# EAGLE board Ringo3 (EAGLE 5.11), part 1 of 2
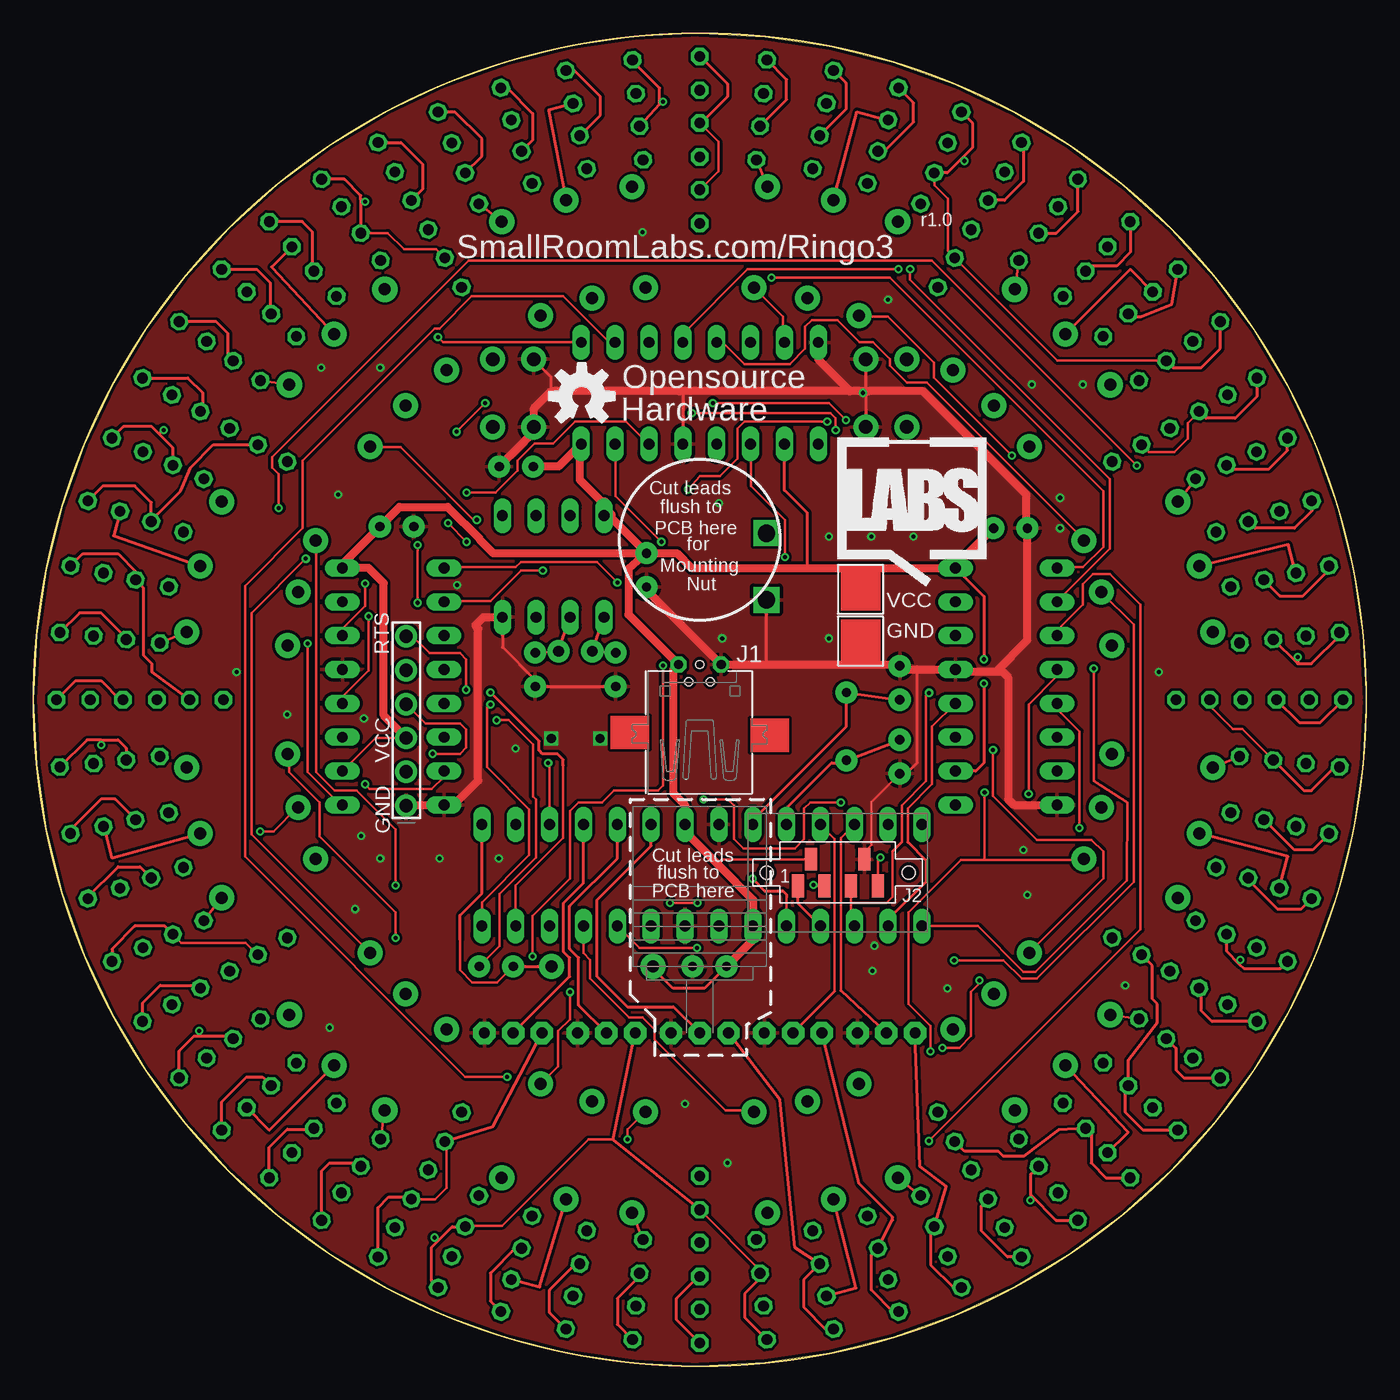
[diagram p2: board, top side]
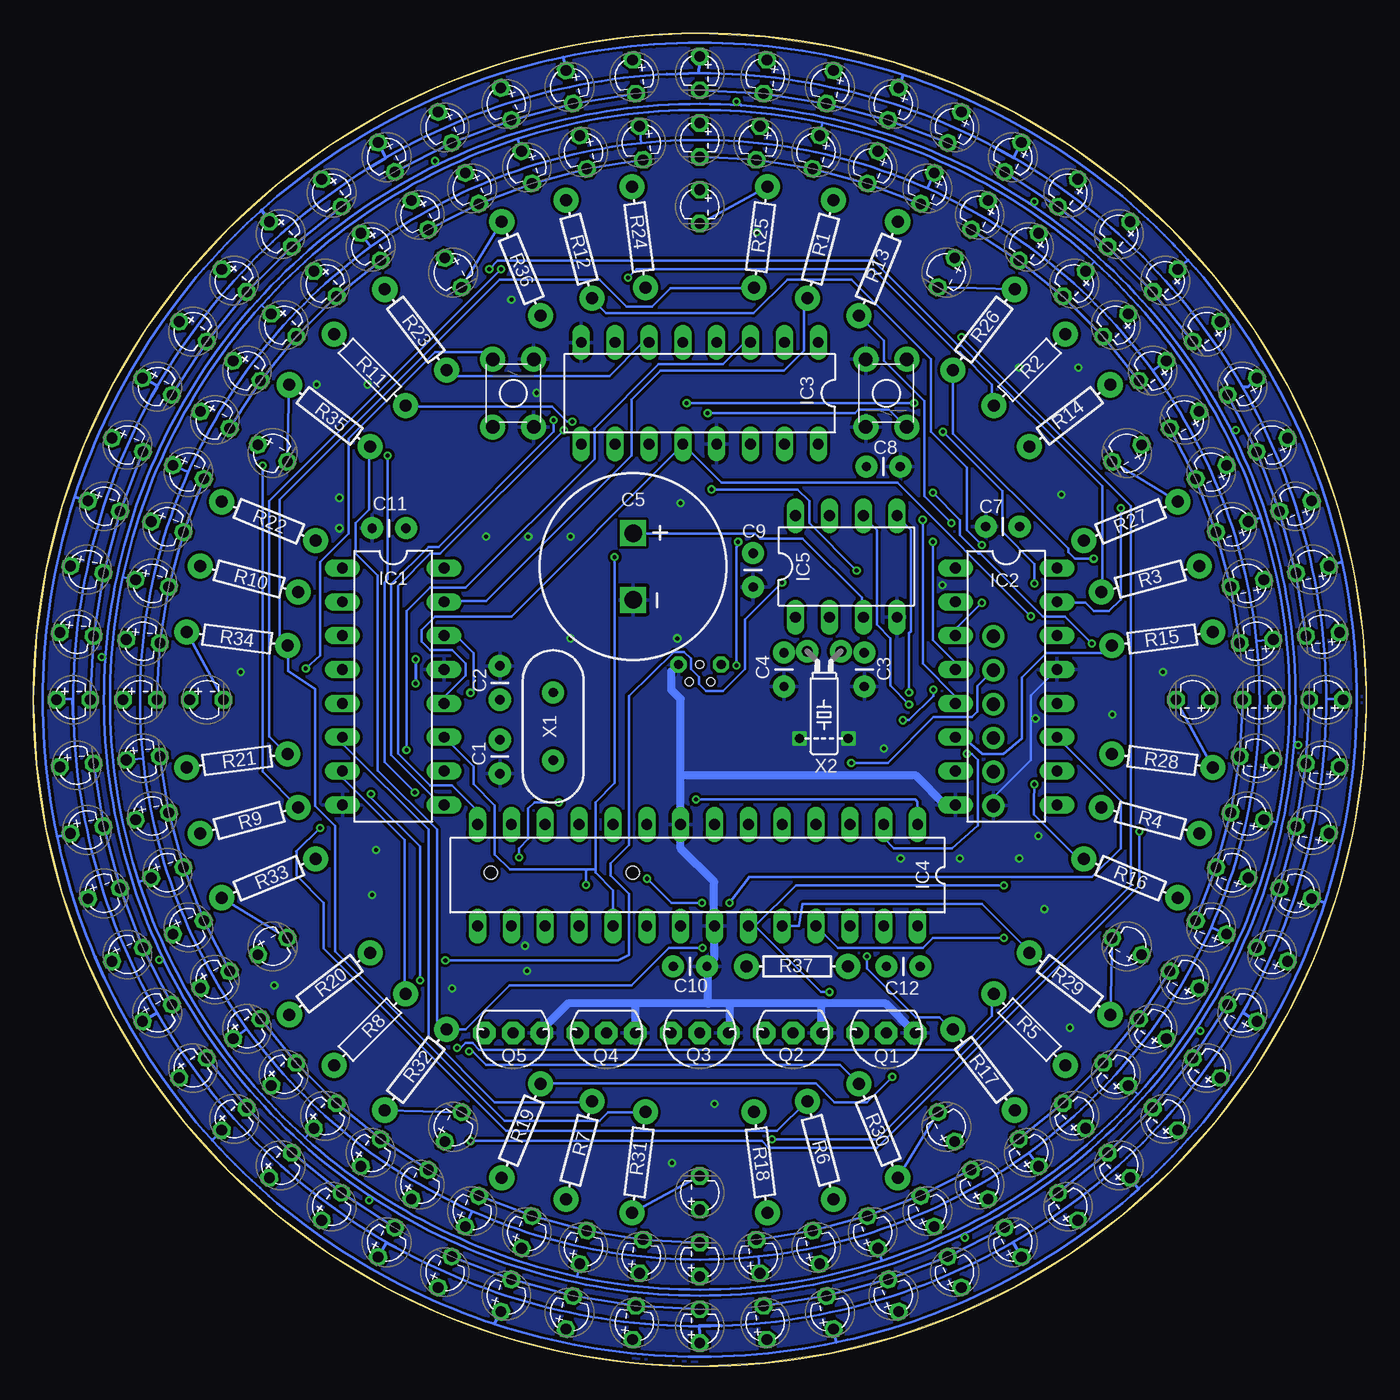
[diagram p3: board, bottom side, seen from below]

Size 100 x 100 mm. Coordinates in mm from the lower left corner, seen from the top.
Outline: 50,100 arc-180 50,0 arc-180 50,100
Copper layers (1*16): Top 0.035mm / dielectric 1.5mm / Bottom 0.035mm
Design rules "Fusion_eagle_rule_v1.1": minimum track width 6mil, minimum drill 12mil, track to track 6mil, track to pad 6mil, pad to pad 6mil, via to via 6mil, smd to smd 0mil, copper to edge 10mil, drill to drill 10mil, minimum pad ring 10mil, minimum via ring 6mil, stop-mask expansion 2mil, vias tented up to drill 100mil, thermal gap 10mil
Net classes: 0 default: width 0.203 mm, drill 0.305 mm, clearance 0.203 mm; 1 power: width 0.203 mm, drill 0.305 mm, clearance 0.203 mm
Milling: area 0,0 to 100,100

## Footprints (pad centres in the part's own frame; a part is rotated, then mirrored left to right if it is on the bottom)
CAP-PTH-SMALL = drill 0.7 pad 1.651 round: 1 0,0; 2 2.54,0
CAP-SUPER13/5 = drill 1.3 square: A -2.5,0; C 2.5,0
1X06_ROUND = drill 1 pad 1.676 round: 1 -6.35,0; 2 -3.81,0; 3 -1.27,0; 4 1.27,0; 5 3.81,0; 6 6.35,0
LED3MM = drill 0.8 octagon: A -1.27,0; C 1.27,0
DIL16 = drill 0.813 long: 1 -8.89,-3.81; 2 -6.35,-3.81; 3 -3.81,-3.81; 4 -1.27,-3.81; 5 1.27,-3.81; 6 3.81,-3.81; 7 6.35,-3.81; 8 8.89,-3.81; 9 8.89,3.81; 10 6.35,3.81; 11 3.81,3.81; 12 1.27,3.81; 13 -1.27,3.81; 14 -3.81,3.81; 15 -6.35,3.81; 16 -8.89,3.81
DIL28-3 = drill 0.813 long: 1 -16.51,-3.81; 2 -13.97,-3.81; 3 -11.43,-3.81; 4 -8.89,-3.81; 5 -6.35,-3.81; 6 -3.81,-3.81; 7 -1.27,-3.81; 8 1.27,-3.81; 9 3.81,-3.81; 10 6.35,-3.81; 11 8.89,-3.81; 12 11.43,-3.81; 13 13.97,-3.81; 14 16.51,-3.81; 15 16.51,3.81; 16 13.97,3.81; 17 11.43,3.81; 18 8.89,3.81; 19 6.35,3.81; 20 3.81,3.81; 21 1.27,3.81; 22 -1.27,3.81; 23 -3.81,3.81; 24 -6.35,3.81; 25 -8.89,3.81; 26 -11.43,3.81; 27 -13.97,3.81; 28 -16.51,3.81
DIL08-LONG = drill 0.813 long: 1 -3.81,-3.81; 2 -1.27,-3.81; 3 1.27,-3.81; 4 3.81,-3.81; 5 3.81,3.81; 6 1.27,3.81; 7 -1.27,3.81; 8 -3.81,3.81
USB-MINIB-PTH-PWR-PAD = drill 0.7 octagon: GND 1.6,4.64; VBUS -1.6,4.64 | hole 0.6: 0,4.648; 0.787,3.353; -0.813,3.353
ISP-TOUCH = smd 0.9 x 1.7: 1 -3,-1; 2 -2,1; 3 -1,-1; 4 1,-1; 5 3,-1; 6 2,1 | hole 1: -5.334,0; 5.334,0
TO92-STRAIGHT = drill 0.813 pad 1.676 octagon: 1 -2.159,0; 2 0,0; 3 2.159,0
AXIAL-0.3 = drill 0.9 pad 1.88 round: P$1 -3.81,0; P$2 3.81,0
TACTILE-PTH-4.5X4.5 = drill 1.016 pad 1.88 round: 1A -2.54,1.54; 1B 2.54,1.54; 2A -2.54,-1.54; 2B 2.54,-1.54
HC49US = drill 0.7 pad 1.651 round: 1 -2.54,0; 2 2.54,0
TC26H = drill 0.813 pad 1.676 round: 1 -1.27,0; 2 1.27,0

## Placement (x,y rotation side)
C1  [CAP-PTH-SMALL]  65,47 270 bottom
C2  [CAP-PTH-SMALL]  65,50 90 bottom
C3  [CAP-PTH-SMALL]  37.66,53.53 270 bottom
C4  [CAP-PTH-SMALL]  43.69,53.53 270 bottom
C5  CAPPOLSUPER13/5  [CAP-SUPER13/5]  55,60 270 bottom
C7  [CAP-PTH-SMALL]  26,63 180 bottom
C8  [CAP-PTH-SMALL]  37.5,67.5 0 bottom
C9  [CAP-PTH-SMALL]  46,61 270 bottom
C10  [CAP-PTH-SMALL]  52,30 0 bottom
C11  [CAP-PTH-SMALL]  72.04,62.87 180 bottom
C12  [CAP-PTH-SMALL]  36,30 0 bottom
CN1  [1X06_ROUND]  27.97,48.4 90 top
D1  LED3MM  [LED3MM]  50,97 270 bottom
D2  LED3MM  [LED3MM]  45.09,96.74 264 bottom
D3  LED3MM  [LED3MM]  40.23,95.97 258 bottom
D4  LED3MM  [LED3MM]  35.48,94.7 252 bottom
D5  LED3MM  [LED3MM]  30.88,92.94 246 bottom
D6  LED3MM  [LED3MM]  26.5,90.7 240 bottom
D7  LED3MM  [LED3MM]  22.37,88.02 234 bottom
D8  LED3MM  [LED3MM]  18.55,84.93 228 bottom
D9  LED3MM  [LED3MM]  15.07,81.45 222 bottom
D10  LED3MM  [LED3MM]  11.98,77.63 216 bottom
D11  LED3MM  [LED3MM]  9.3,73.5 210 bottom
D12  LED3MM  [LED3MM]  7.06,69.12 204 bottom
D13  LED3MM  [LED3MM]  5.3,64.52 198 bottom
D14  LED3MM  [LED3MM]  4.03,59.77 192 bottom
D15  LED3MM  [LED3MM]  3.26,54.91 186 bottom
D16  LED3MM  [LED3MM]  3,50 180 bottom
D17  LED3MM  [LED3MM]  3.26,45.09 174 bottom
D18  LED3MM  [LED3MM]  4.03,40.23 168 bottom
D19  LED3MM  [LED3MM]  5.3,35.48 162 bottom
D20  LED3MM  [LED3MM]  7.06,30.88 156 bottom
D21  LED3MM  [LED3MM]  9.3,26.5 150 bottom
D22  LED3MM  [LED3MM]  11.98,22.37 144 bottom
D23  LED3MM  [LED3MM]  15.07,18.55 138 bottom
D24  LED3MM  [LED3MM]  18.55,15.07 132 bottom
D25  LED3MM  [LED3MM]  22.37,11.98 126 bottom
D26  LED3MM  [LED3MM]  26.5,9.3 120 bottom
D27  LED3MM  [LED3MM]  30.88,7.06 114 bottom
D28  LED3MM  [LED3MM]  35.48,5.3 108 bottom
D29  LED3MM  [LED3MM]  40.23,4.03 102 bottom
D30  LED3MM  [LED3MM]  45.09,3.26 96 bottom
D31  LED3MM  [LED3MM]  50,3 90 bottom
D32  LED3MM  [LED3MM]  54.91,3.26 84 bottom
D33  LED3MM  [LED3MM]  59.77,4.03 78 bottom
D34  LED3MM  [LED3MM]  64.52,5.3 72 bottom
D35  LED3MM  [LED3MM]  69.12,7.06 66 bottom
D36  LED3MM  [LED3MM]  73.5,9.3 60 bottom
D37  LED3MM  [LED3MM]  77.63,11.98 54 bottom
D38  LED3MM  [LED3MM]  81.45,15.07 48 bottom
D39  LED3MM  [LED3MM]  84.93,18.55 42 bottom
D40  LED3MM  [LED3MM]  88.02,22.37 36 bottom
D41  LED3MM  [LED3MM]  90.7,26.5 30 bottom
D42  LED3MM  [LED3MM]  92.94,30.88 24 bottom
D43  LED3MM  [LED3MM]  94.7,35.48 18 bottom
D44  LED3MM  [LED3MM]  95.97,40.23 12 bottom
D45  LED3MM  [LED3MM]  96.74,45.09 6 bottom
D46  LED3MM  [LED3MM]  97,50 0 bottom
D47  LED3MM  [LED3MM]  96.74,54.91 354 bottom
D48  LED3MM  [LED3MM]  95.97,59.77 348 bottom
D49  LED3MM  [LED3MM]  94.7,64.52 342 bottom
D50  LED3MM  [LED3MM]  92.94,69.12 336 bottom
D51  LED3MM  [LED3MM]  90.7,73.5 330 bottom
D52  LED3MM  [LED3MM]  88.02,77.63 324 bottom
D53  LED3MM  [LED3MM]  84.93,81.45 318 bottom
D54  LED3MM  [LED3MM]  81.45,84.93 312 bottom
D55  LED3MM  [LED3MM]  77.63,88.02 306 bottom
D56  LED3MM  [LED3MM]  73.5,90.7 300 bottom
D57  LED3MM  [LED3MM]  69.12,92.94 294 bottom
D58  LED3MM  [LED3MM]  64.52,94.7 288 bottom
D59  LED3MM  [LED3MM]  59.77,95.97 282 bottom
D60  LED3MM  [LED3MM]  54.91,96.74 276 bottom
D61  LED3MM  [LED3MM]  50,92 270 bottom
D62  LED3MM  [LED3MM]  45.61,91.77 264 bottom
D63  LED3MM  [LED3MM]  41.27,91.08 258 bottom
D64  LED3MM  [LED3MM]  37.02,89.94 252 bottom
D65  LED3MM  [LED3MM]  32.92,88.37 246 bottom
D66  LED3MM  [LED3MM]  29,86.37 240 bottom
D67  LED3MM  [LED3MM]  25.31,83.98 234 bottom
D68  LED3MM  [LED3MM]  21.9,81.21 228 bottom
D69  LED3MM  [LED3MM]  18.79,78.1 222 bottom
D70  LED3MM  [LED3MM]  16.02,74.69 216 bottom
D71  LED3MM  [LED3MM]  13.63,71 210 bottom
D72  LED3MM  [LED3MM]  11.63,67.08 204 bottom
D73  LED3MM  [LED3MM]  10.06,62.98 198 bottom
D74  LED3MM  [LED3MM]  8.92,58.73 192 bottom
D75  LED3MM  [LED3MM]  8.23,54.39 186 bottom
D76  LED3MM  [LED3MM]  8,50 180 bottom
D77  LED3MM  [LED3MM]  8.23,45.61 174 bottom
D78  LED3MM  [LED3MM]  8.92,41.27 168 bottom
D79  LED3MM  [LED3MM]  10.06,37.02 162 bottom
D80  LED3MM  [LED3MM]  11.63,32.92 156 bottom
D81  LED3MM  [LED3MM]  13.63,29 150 bottom
D82  LED3MM  [LED3MM]  16.02,25.31 144 bottom
D83  LED3MM  [LED3MM]  18.79,21.9 138 bottom
D84  LED3MM  [LED3MM]  21.9,18.79 132 bottom
D85  LED3MM  [LED3MM]  25.31,16.02 126 bottom
D86  LED3MM  [LED3MM]  29,13.63 120 bottom
D87  LED3MM  [LED3MM]  32.92,11.63 114 bottom
D88  LED3MM  [LED3MM]  37.02,10.06 108 bottom
D89  LED3MM  [LED3MM]  41.27,8.92 102 bottom
D90  LED3MM  [LED3MM]  45.61,8.23 96 bottom
D91  LED3MM  [LED3MM]  50,8 90 bottom
D92  LED3MM  [LED3MM]  54.39,8.23 84 bottom
D93  LED3MM  [LED3MM]  58.73,8.92 78 bottom
D94  LED3MM  [LED3MM]  62.98,10.06 72 bottom
D95  LED3MM  [LED3MM]  67.08,11.63 66 bottom
D96  LED3MM  [LED3MM]  71,13.63 60 bottom
D97  LED3MM  [LED3MM]  74.69,16.02 54 bottom
D98  LED3MM  [LED3MM]  78.1,18.79 48 bottom
D99  LED3MM  [LED3MM]  81.21,21.9 42 bottom
D100  LED3MM  [LED3MM]  83.98,25.31 36 bottom
D101  LED3MM  [LED3MM]  86.37,29 30 bottom
D102  LED3MM  [LED3MM]  88.37,32.92 24 bottom
D103  LED3MM  [LED3MM]  89.94,37.02 18 bottom
D104  LED3MM  [LED3MM]  91.08,41.27 12 bottom
D105  LED3MM  [LED3MM]  91.77,45.61 6 bottom
D106  LED3MM  [LED3MM]  92,50 0 bottom
D107  LED3MM  [LED3MM]  91.77,54.39 354 bottom
D108  LED3MM  [LED3MM]  91.08,58.73 348 bottom
D109  LED3MM  [LED3MM]  89.94,62.98 342 bottom
D110  LED3MM  [LED3MM]  88.37,67.08 336 bottom
D111  LED3MM  [LED3MM]  86.37,71 330 bottom
D112  LED3MM  [LED3MM]  83.98,74.69 324 bottom
D113  LED3MM  [LED3MM]  81.21,78.1 318 bottom
D114  LED3MM  [LED3MM]  78.1,81.21 312 bottom
D115  LED3MM  [LED3MM]  74.69,83.98 306 bottom
D116  LED3MM  [LED3MM]  71,86.37 300 bottom
D117  LED3MM  [LED3MM]  67.08,88.37 294 bottom
D118  LED3MM  [LED3MM]  62.98,89.94 288 bottom
D119  LED3MM  [LED3MM]  58.73,91.08 282 bottom
D120  LED3MM  [LED3MM]  54.39,91.77 276 bottom
D121  LED3MM  [LED3MM]  50,87 270 bottom
D122  LED3MM  [LED3MM]  31.5,82.04 240 bottom
D123  LED3MM  [LED3MM]  17.96,68.5 210 bottom
D124  LED3MM  [LED3MM]  13,50 180 bottom
D125  LED3MM  [LED3MM]  17.96,31.5 150 bottom
D126  LED3MM  [LED3MM]  31.5,17.96 120 bottom
D127  LED3MM  [LED3MM]  50,13 90 bottom
D128  LED3MM  [LED3MM]  68.5,17.96 60 bottom
D129  LED3MM  [LED3MM]  82.04,31.5 30 bottom
D130  LED3MM  [LED3MM]  87,50 0 bottom
D131  LED3MM  [LED3MM]  82.04,68.5 330 bottom
D132  LED3MM  [LED3MM]  68.5,82.04 300 bottom
IC1  74HCT595N  [DIL16]  73,51 270 bottom
IC2  74HCT595N  [DIL16]  27,51 270 bottom
IC3  74HCT595N  [DIL16]  50,73 180 bottom
IC4  MEGA8-P  [DIL28-3]  50.16,36.83 180 bottom
IC5  MCP79410DIL  [DIL08-LONG]  39,60 0 bottom
J1  USB-PWRPAD  [USB-MINIB-PTH-PWR-PAD]  50,48 0 top
J2  AVR-ISP6_TOUCH  [ISP-TOUCH]  60.35,37.03 0 top
Q1  N-FETSTR  [TO92-STRAIGHT]  36,25 180 bottom
Q2  N-FETSTR  [TO92-STRAIGHT]  43,25 180 bottom
Q3  N-FETSTR  [TO92-STRAIGHT]  50,25 180 bottom
Q4  N-FETSTR  [TO92-STRAIGHT]  57,25 180 bottom
Q5  N-FETSTR  [TO92-STRAIGHT]  64,25 180 bottom
R1  [AXIAL-0.3]  40.94,83.81 75 bottom
R2  [AXIAL-0.3]  25.25,74.75 45 bottom
R3  [AXIAL-0.3]  16.19,59.06 15 bottom
R4  [AXIAL-0.3]  16.19,40.94 345 bottom
R5  [AXIAL-0.3]  25.25,25.25 315 bottom
R6  [AXIAL-0.3]  40.94,16.19 285 bottom
R7  [AXIAL-0.3]  59.06,16.19 255 bottom
R8  [AXIAL-0.3]  74.75,25.25 225 bottom
R9  [AXIAL-0.3]  83.81,40.94 195 bottom
R10  [AXIAL-0.3]  83.81,59.06 165 bottom
R11  [AXIAL-0.3]  74.75,74.75 135 bottom
R12  [AXIAL-0.3]  59.06,83.81 105 bottom
R13  [AXIAL-0.3]  36.61,82.34 67.5 bottom
R14  [AXIAL-0.3]  22.23,71.31 37.5 bottom
R15  [AXIAL-0.3]  15.3,54.57 7.5 bottom
R16  [AXIAL-0.3]  17.66,36.61 337.5 bottom
R17  [AXIAL-0.3]  28.69,22.23 307.5 bottom
R18  [AXIAL-0.3]  45.43,15.3 277.5 bottom
R19  [AXIAL-0.3]  63.39,17.66 247.5 bottom
R20  [AXIAL-0.3]  77.77,28.69 217.5 bottom
R21  [AXIAL-0.3]  84.7,45.43 187.5 bottom
R22  [AXIAL-0.3]  82.34,63.39 157.5 bottom
R23  [AXIAL-0.3]  71.31,77.77 127.5 bottom
R24  [AXIAL-0.3]  54.57,84.7 97.5 bottom
R25  [AXIAL-0.3]  45.43,84.7 82.5 bottom
R26  [AXIAL-0.3]  28.69,77.77 52.5 bottom
R27  [AXIAL-0.3]  17.66,63.39 22.5 bottom
R28  [AXIAL-0.3]  15.3,45.43 352.5 bottom
R29  [AXIAL-0.3]  22.23,28.69 322.5 bottom
R30  [AXIAL-0.3]  36.61,17.66 292.5 bottom
R31  [AXIAL-0.3]  54.57,15.3 262.5 bottom
R32  [AXIAL-0.3]  71.31,22.23 232.5 bottom
R33  [AXIAL-0.3]  82.34,36.61 202.5 bottom
R34  [AXIAL-0.3]  84.7,54.57 172.5 bottom
R35  [AXIAL-0.3]  77.77,71.31 142.5 bottom
R36  [AXIAL-0.3]  63.39,82.34 112.5 bottom
R37  [AXIAL-0.3]  42.68,30 0 bottom
U$17  TACTILETACT-4.5X4.5-PTH  [TACTILE-PTH-4.5X4.5]  36,73 90 bottom
U$18  TACTILETACT-4.5X4.5-PTH  [TACTILE-PTH-4.5X4.5]  64,73 270 bottom
U$21  [OSHW-LOGO-M]  41.15,72.77 0 top
U$22  [SRL-LOGO-SILK-10MM]  60.35,58.52 0 top
X1  [HC49US]  61,48 90 bottom
X2  [TC26H]  40.67,53.64 180 bottom